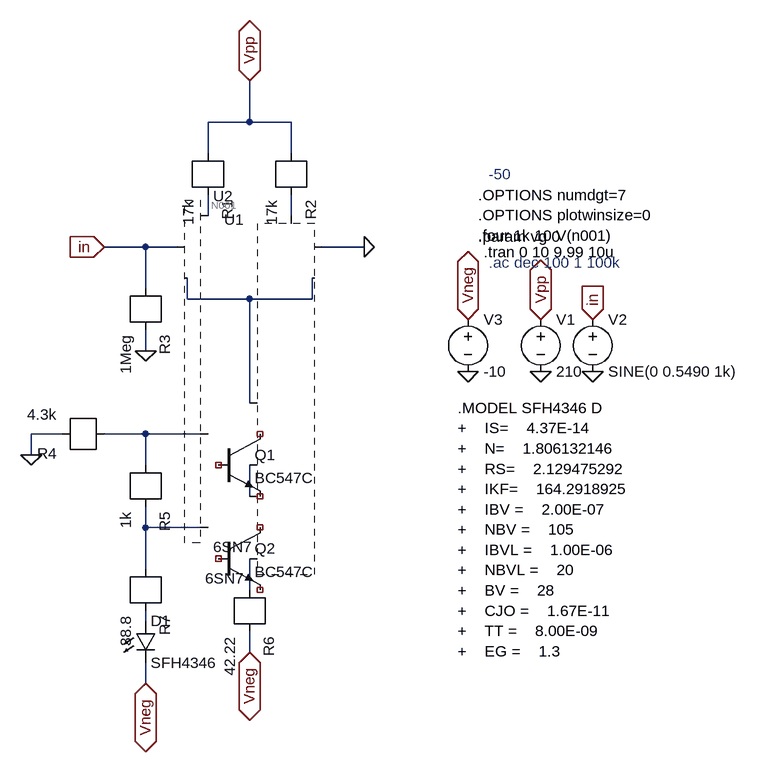
[diagram p0: schematic amp_TCC_diff_V0.1.asc]
amp_TCC_diff_V0.1.asc, the LTspice schematic file:
Version 4
SHEET 1 880 1344
WIRE -16 240 -16 176
WIRE -16 240 -80 240
WIRE 48 240 -16 240
WIRE -80 288 -80 240
WIRE 48 288 48 240
WIRE -80 384 -80 352
WIRE 48 384 48 352
WIRE -176 432 -240 432
WIRE -128 432 -176 432
WIRE 160 432 96 432
WIRE -176 496 -176 432
WIRE -112 512 -112 480
WIRE -16 512 -112 512
WIRE 80 512 80 480
WIRE 80 512 -16 512
WIRE -176 592 -176 560
WIRE -16 672 -16 512
WIRE -304 720 -352 720
WIRE -176 720 -240 720
WIRE -80 720 -176 720
WIRE -352 752 -352 720
WIRE -176 768 -176 720
WIRE -16 816 -16 768
WIRE -176 864 -176 832
WIRE -80 864 -176 864
WIRE -176 928 -176 864
WIRE -16 960 -16 912
WIRE -176 1008 -176 992
WIRE -16 1056 -16 1024
WIRE -176 1104 -176 1072
FLAG 432 624 0
FLAG -16 176 Vpp
IOPIN -16 176 BiDir
FLAG 432 544 Vpp
IOPIN 432 544 BiDir
FLAG 512 544 in
IOPIN 512 544 In
FLAG 512 624 0
FLAG 320 624 0
FLAG 320 544 Vneg
IOPIN 320 544 BiDir
FLAG -240 432 in
IOPIN -240 432 In
FLAG -352 752 0
FLAG 160 432 0
FLAG -176 592 0
FLAG -16 1056 Vneg
IOPIN -16 1056 BiDir
FLAG -176 1104 Vneg
IOPIN -176 1104 BiDir
SYMBOL Tubes/6SN7 48 432 M0
SYMATTR InstName U1
SYMBOL voltage 432 528 R0
SYMATTR InstName V1
SYMATTR Value 210
SYMBOL voltage 512 528 R0
SYMATTR InstName V2
SYMATTR Value SINE(0 0.5490 1k)
SYMBOL voltage 320 528 R0
SYMATTR InstName V3
SYMATTR Value -10
SYMBOL Tubes/6SN7 -80 432 R0
SYMATTR InstName U2
SYMBOL r -80 288 R90
SYMATTR InstName R1
SYMATTR Value 17k
SYMBOL r 48 288 R90
SYMATTR InstName R2
SYMATTR Value 17k
SYMBOL r -176 496 R90
SYMATTR InstName R3
SYMATTR Value 1Meg
SYMBOL LED -192 1008 R0
SYMATTR InstName D1
SYMATTR Value SFH4346
SYMBOL r -240 720 R180
SYMATTR InstName R4
SYMATTR Value 4.3k
SYMBOL r -176 768 R90
SYMATTR InstName R5
SYMATTR Value 1k
SYMBOL r -16 960 R90
SYMATTR InstName R6
SYMATTR Value 42.22
SYMBOL npn -64 720 R0
SYMATTR InstName Q1
SYMATTR Value BC547C
SYMBOL npn -64 864 R0
SYMATTR InstName Q2
SYMATTR Value BC547C
SYMBOL r -176 928 R90
SYMATTR InstName R7
SYMATTR Value 38.8
TEXT 336 416 Left 2 !.param vg 0
TEXT 344 440 Left 2 !.tran 0 10 9.99 10u
TEXT 336 352 Left 2 !.OPTIONS numdgt=7\n.OPTIONS plotwinsize=0\n.four 1k 10 V(n001)
TEXT 352 320 Left 2 ;-50
TEXT 352 456 Left 2 ;.ac dec 100 1 100k
TEXT 304 680 Left 2 !.MODEL SFH4346 D	\n+	IS=	4.37E-14\n+	N=	1.806132146\n+	RS=	2.129475292\n+	IKF=	164.2918925\n+	IBV =	2.00E-07\n+	NBV =	105\n+	IBVL =	1.00E-06\n+	NBVL =	20\n+	BV =	28\n+	CJO =	1.67E-11\n+	TT =	8.00E-09\n+	EG =	1.3

The netlist it stands for:
* amp_TCC_diff_V0.1.asc
* U1: 6SN7 (symbol Tubes/6SN7 not available, pin order unknown); nets seen at it: 0, N002, N003, N005, N007
V1 Vpp 0 210
V2 in 0 SINE(0 0.5490 1k)
V3 Vneg 0 -10
* U2: 6SN7 (symbol Tubes/6SN7 not available, pin order unknown); nets seen at it: in, N001, N003, N004, N006
R1 N001 Vpp 17k
R2 N002 Vpp 17k
R3 0 in 1Meg
D1 N008 Vneg SFH4346
R4 0 N004 4.3k
R5 N006 N004 1k
R6 Vneg N007 42.22
Q1 NC_01 NC_02 NC_03 0 BC547C
Q2 NC_04 NC_05 NC_06 0 BC547C
R7 N008 N006 38.8
.model D D
.lib standard.dio
.model NPN NPN
.model PNP PNP
.lib standard.bjt
.param vg 0
.tran 0 10 9.99 10u
.OPTIONS numdgt=7
.OPTIONS plotwinsize=0
.four 1k 10 V(n001)
* -50
* .ac dec 100 1 100k
.MODEL SFH4346 D
+	IS=	4.37E-14
+	N=	1.806132146
+	RS=	2.129475292
+	IKF=	164.2918925
+	IBV =	2.00E-07
+	NBV =	105
+	IBVL =	1.00E-06
+	NBVL =	20
+	BV =	28
+	CJO =	1.67E-11
+	TT =	8.00E-09
+	EG =	1.3
.backanno
.end